# EAGLE schematic BYOB-BoosterPack-Template (EAGLE 7.3.0)
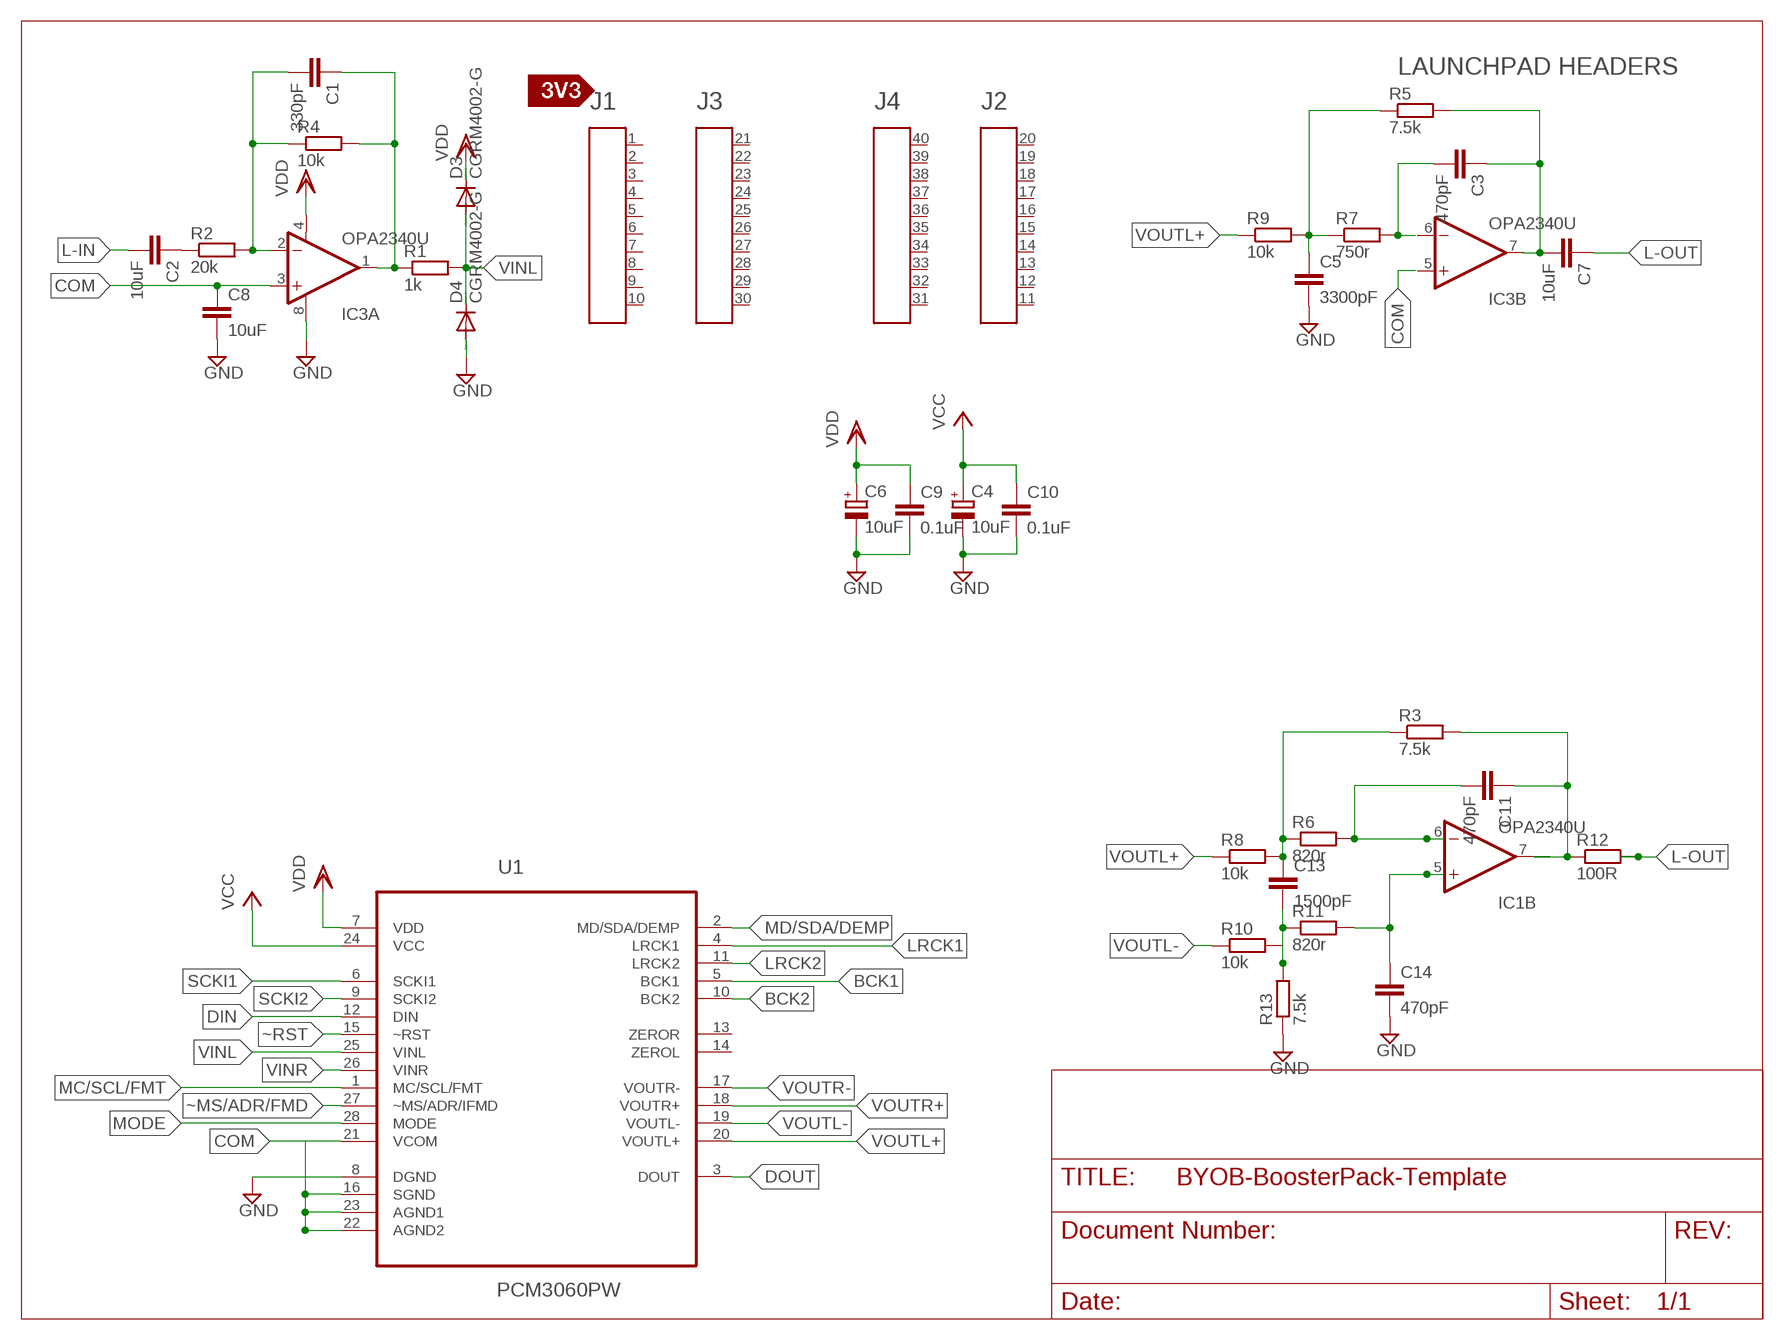
[diagram p0: schematic, sheet 1]

## Parts
A1  HEADER4X10-BOOSTERPACK  [4X10-BOOSTERPACK]
C1  330pF  C-EUC1608  [C1608]
C2  10uF  C-EUC1608  [C1608]
C3  470pF  C-EUC1608  [C1608]
C4  10uF  CPOL-EU150CLZ-1010  [150CLZ-1010]
C5  3300pF  C-EUC1608  [C1608]
C6  10uF  CPOL-EU150CLZ-1010  [150CLZ-1010]
C7  10uF  C-EUC1608  [C1608]
C8  10uF  C-EUC1608  [C1608]
C9  0.1uF  C-EUC1608  [C1608]
C10  0.1uF  C-EUC1608  [C1608]
C11  470pF  C-EUC1608  [C1608]
C13  1500pF  C-EUC1608  [C1608]
C14  470pF  C-EUC1608  [C1608]
D3  CGRM4002-G  [SOD-123_MINI-SMA]
D4  CGRM4002-G  [SOD-123_MINI-SMA]
IC1  OPA2340U  [SO08]
IC3  OPA2340U  [SO08]
R1  1k  R-EU_R1206  [R1206]
R2  20k  R-EU_R1206  [R1206]
R3  7.5k  R-EU_R1206  [R1206]
R4  10k  R-EU_R1206  [R1206]
R5  7.5k  R-EU_R1206  [R1206]
R6  820r  R-EU_R1206  [R1206]
R7  750r  R-EU_R1206  [R1206]
R8  10k  R-EU_R1206  [R1206]
R9  10k  R-EU_R1206  [R1206]
R10  10k  R-EU_R1206  [R1206]
R11  820r  R-EU_R1206  [R1206]
R12  100R  R-EU_R1206  [R1206]
R13  7.5k  R-EU_R1206  [R1206]
U1  PCM3060PW  [SOP65P640X120-28N]
U$3  SILK_3V3_TAG  [SILK_3V3_TAG]

## Nets
BCK1: U1.5(BCK1)
BCK2: U1.10(BCK2)
COM: C8.1 C14.1 IC1.5(B:+IN) IC3.3(A:+IN) R11.2 U1.16(SGND) U1.21(VCOM) U1.22(AGND2) U1.23(AGND1)
DIN: U1.12(DIN)
DOUT: U1.3(DOUT)
GND: C4.- C5.2 C6.- C8.2 C9.2 C10.2 C14.2 D4.A IC3.8(A:V+) R13.1 U1.8(DGND)
L-IN: C2.2
L-OUT: C7.1 R12.2
LRCK1: U1.4(LRCK1)
LRCK2: U1.11(LRCK2)
MC/SCL/FMT: U1.1(MC/SCL/FMT)
MD/SDA/DEMP: U1.2(MD/SDA/DEMP)
MODE: U1.28(MODE)
N$1: C1.1 IC3.1(A:OUT) R1.1 R4.2
N$2: C2.1 R2.1
N$3: C1.2 IC3.2(A:-IN) R2.2 R4.1
N$4: C3.1 C7.2 IC3.7(B:OUT) R5.2
N$5: C11.1 IC1.7(B:OUT) R3.2 R12.1
N$6: C3.2 R7.2
N$7: C5.1 R5.1 R7.1 R9.2
N$8: C11.2 IC1.6(B:-IN) R6.2
N$9: C13.1 R3.1 R6.1 R8.2
N$10: C13.2 R10.2 R11.1 R13.2
SCKI1: U1.6(SCKI1)
SCKI2: U1.9(SCKI2)
VCC: C4.+ C10.1 U1.24(VCC)
VDD: C6.+ C9.1 D3.C IC3.4(A:V-) U1.7(VDD)
VINL: D3.A D4.C R1.2 U1.25(VINL)
VINR: U1.26(VINR)
VOUTL+: R8.1 R9.1 U1.20(VOUTL+)
VOUTL-: R10.1 U1.19(VOUTL-)
VOUTR+: U1.18(VOUTR+)
VOUTR-: U1.17(VOUTR-)
~MS/ADR/FMD: U1.27(~MS/ADR/IFMD)
~RST: U1.15(~RST)
Unconnected: A1.1 A1.2 A1.3 A1.4 A1.5 A1.6 A1.7 A1.8 A1.9 A1.10 A1.11 A1.12 A1.13 A1.14 A1.15 A1.16 A1.17 A1.18 A1.19 A1.20 A1.21 A1.22 A1.23 A1.24 A1.25 A1.26 A1.27 A1.28 A1.29 A1.30 A1.31 A1.32 A1.33 A1.34 A1.35 A1.36 A1.37 A1.38 A1.39 A1.40 IC1.1(A:OUT) IC1.2(A:-IN) IC1.3(A:+IN) IC3.5(B:+IN) IC3.6(B:-IN) U1.13(ZEROR) U1.14(ZEROL)

## Notes on the sheet
- LAUNCHPAD HEADERS

## Power pins joined to a net without a drawn wire
V+: IC1.8(A:V+)
V-: IC1.4(A:V-)

## Library data of the parts
A1 = Public_BP_Library:HEADER4X10-BOOSTERPACK
C1-C3 C5 C7-C11 C13 C14 = rcl:C-EU: CAPACITOR, European symbol
C4 C6 = rcl:CPOL-EU: POLARIZED CAPACITOR, European symbol
D3 D4 = diode:CGRM400*-G: Molded plasitc,JEDEC SOD-123/Mini SMA Source: Comchip CGRM4001-G.pdf
IC1 IC3 = burr-brown:OPA2340: Single-Supply, Rail-to-Rail Operational Amplifiers MicroAmplifier(TM) Series; Product Folder:OPA2340; MF: TEXAS INSTRUMENTS; MPN: OPA2340UA; OC_FARNELL: 1101541; OC_NEWARK: 36K7581
R1-R13 = rcl:R-EU_: RESISTOR, European symbol
U1 = ti-codec:PCM3060PW: ASYNCHRONOUS STEREO AUDIO CODEC; MPN: PCM3060PW; OC_FARNELL: 1390706; OC_NEWARK: 36M9294; PACKAGE: TSSOP-28; SUPPLIER: Texas Instruments
U$3 = Public_BP_Library:SILK_3V3_TAG